# EAGLE design WaterSens_V1-0 (EAGLE 9.6.2)
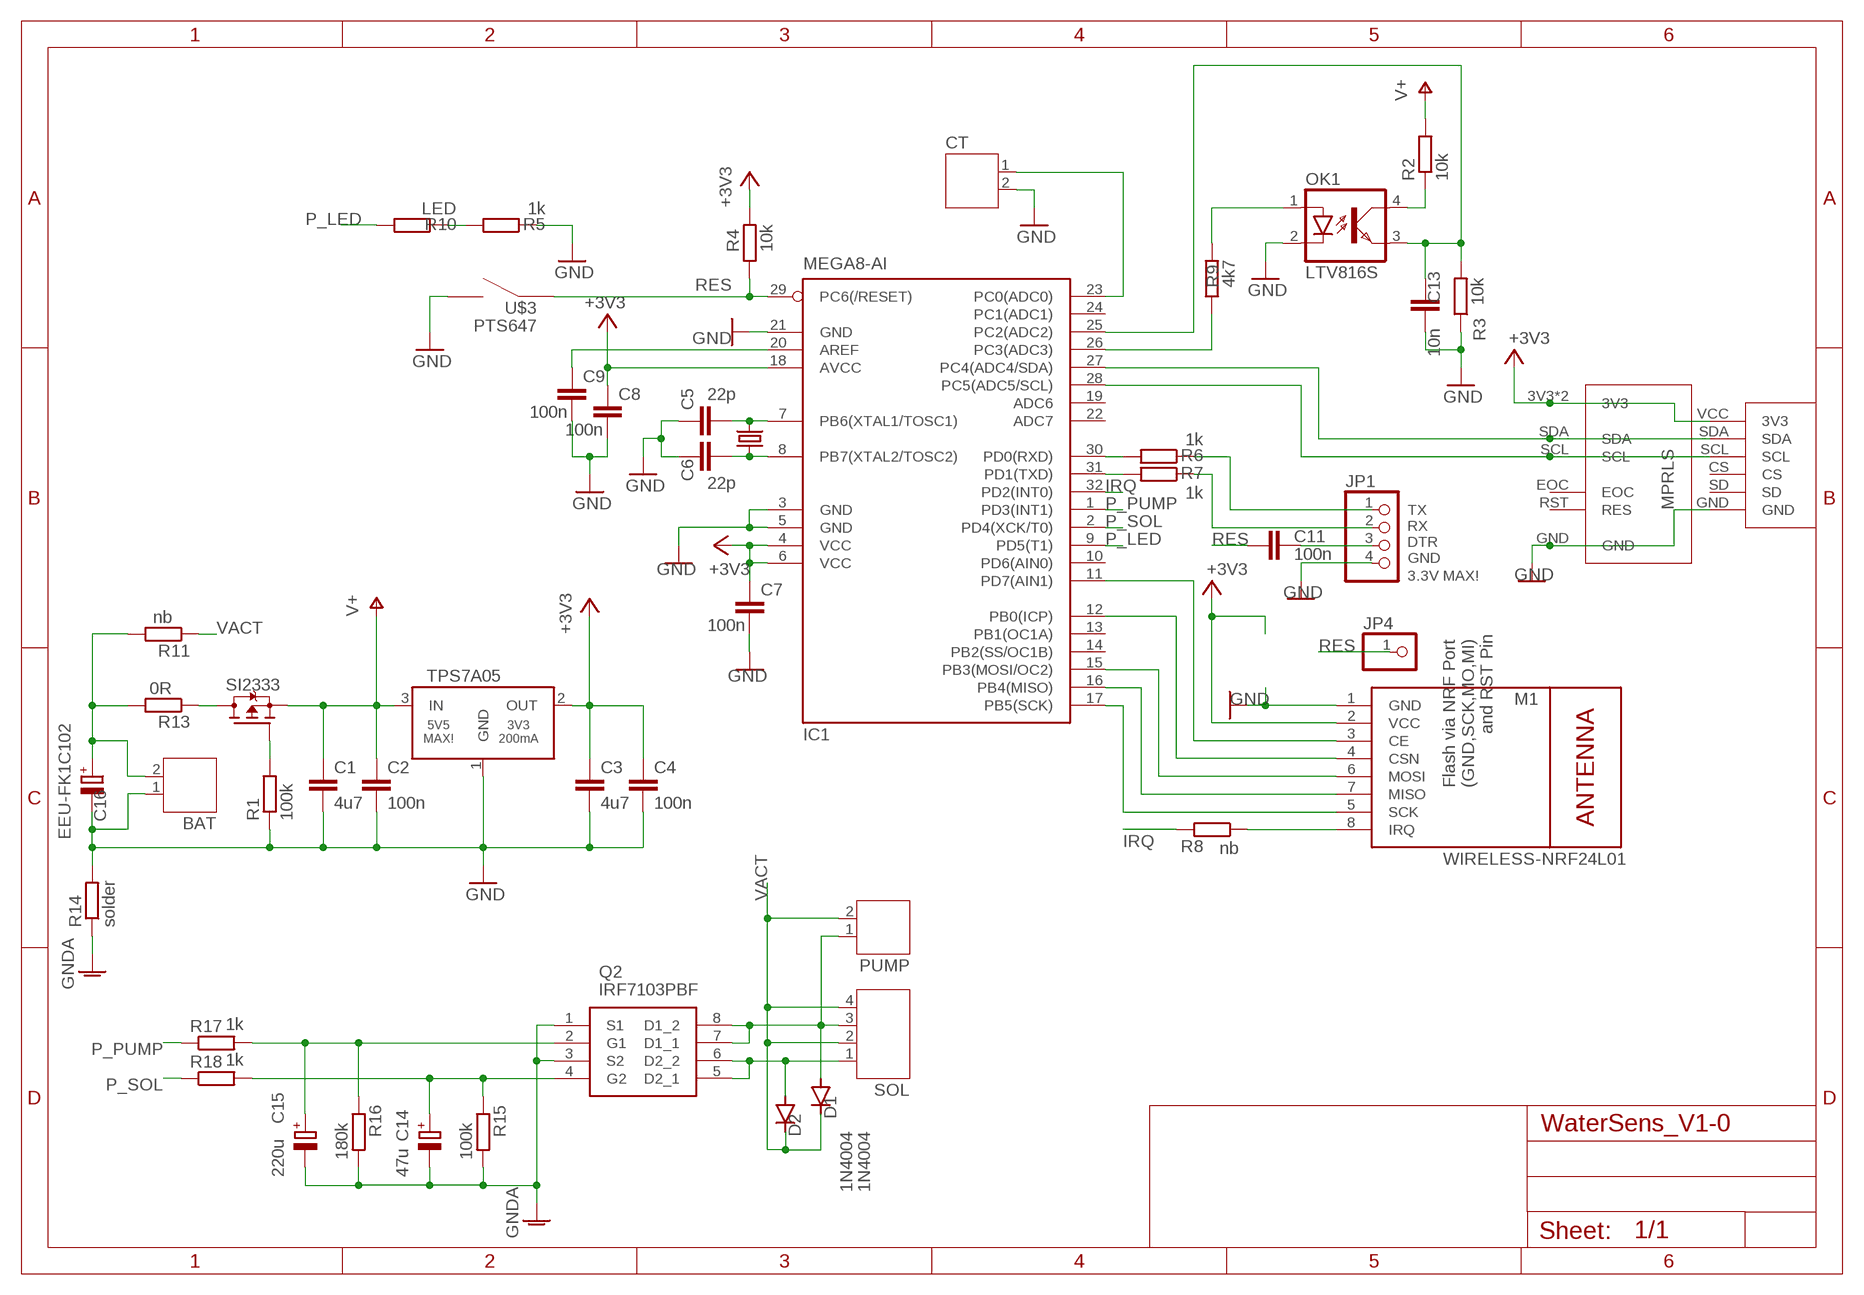
[diagram p0: schematic, sheet 1]

## Parts
BAT  JST-PH2  [JST-PH2]
C1  4u7  C-EUC0805  [C0805]
C2  100n  C-EUC0805  [C0805]
C3  4u7  C-EUC0805  [C0805]
C4  100n  C-EUC0805  [C0805]
C5  22p  C-EUC0805  [C0805]
C6  22p  C-EUC0805  [C0805]
C7  100n  C-EUC0805  [C0805]
C8  100n  C-EUC0805  [C0805]
C9  100n  C-EUC0805  [C0805]
C11  100n  C-EUC0805  [C0805]
C13  10n  C-EUC0805  [C0805]
C14  47u  CPOL-EUE1.8-4  [E1,8-4]
C15  220u  CPOL-EUE2,5-6E  [E2,5-6E]
C16  EEU-FK1C102  CPOL-EUE5-10.5  [E5-10,5]
CT  JST-PH2  [JST-PH2]
D1  1N4004  [DO41-10]
D2  1N4004  [DO41-10]
IC1  MEGA8-AI  [TQFP32-08]
JP1  PINHD-1X4  [1X04]
JP4  PINHD-1X1  [1X01]
M1  WIRELESS-NRF24L01  [WIRELESS-NRF24L01]
OK1  LTV816S  [DIL4-SMD]
PUMP  JST-PH2  [JST-PH2]
Q1  CRYSTALHC49UP  [HC49UP]
Q2  IRF7103PBF  [SOIC127P600X175-8N]
R1  100k  R-EU_R0805  [R0805]
R2  10k  R-EU_R0805  [R0805]
R3  10k  R-EU_R0805  [R0805]
R4  10k  R-EU_R0805  [R0805]
R5  1k  R-EU_R0805  [R0805]
R6  1k  R-EU_R0805  [R0805]
R7  1k  R-EU_R0805  [R0805]
R8  nb  R-EU_R0805  [R0805]
R9  4k7  R-EU_R0805  [R0805]
R10  LED  R-EU_R0805  [R0805]
R11  nb  R-EU_R0805  [R0805]
R13  0R  R-EU_R0805  [R0805]
R14  solder  R-EU_R0805  [R0805]
R15  100k  R-EU_R0805  [R0805]
R16  180k  R-EU_R0805  [R0805]
R17  1k  R-EU_R0805  [R0805]
R18  1k  R-EU_R0805  [R0805]
SOL  JST-PH4  [JST-PH4]
U$1  MPRLS_ADA  [MPRLS_ADA]
U$2  TEMP-HUM-PRES-BME280-3V3  [TEMP-HUM-PRES-BME280-3V3]
U$3  PTS647  [PTS647]
U$5  TPS7A05  [SOT23]
U$6  SI2333  [SOT23]

## Nets
+3V3: C3.1 C4.1 C7.1 C8.1 IC1.4(VCC) IC1.6(VCC) IC1.18(AVCC) M1.2(VCC) R4.2 U$1.3V3 U$1.VIN(3V3) U$2.VCC(3V3) U$5.2(OUT)
GND: BAT.1 C1.2 C2.2 C3.2 C4.2 C5.1 C6.1 C7.2 C8.2 C9.2 C13.1 C16.- CT.2 IC1.3(GND) IC1.5(GND) IC1.21(GND) JP1.4 M1.1(GND) OK1.2(C) R1.1 R3.1 R5.1 R14.2 U$1.GND U$2.GND U$3.3 U$3.4 U$5.1(GND)
GNDA: C14.- C15.- Q2.1(S1) Q2.3(S2) R14.1 R15.2 R16.2
IRQ: IC1.32(PD2(INT0)) R8.2
N$1: IC1.27(PC4(ADC4/SDA)) U$1.SDA U$2.SDA
N$2: IC1.28(PC5(ADC5/SCL)) U$1.SCL U$2.SCL
N$3: BAT.2 C16.+ R11.2 R13.2
N$4: C5.2 IC1.7(PB6(XTAL1/TOSC1)) Q1.2
N$5: R1.2 U$6.1(G)
N$6: OK1.4(COL) R2.1
N$7: C14.+ Q2.4(G2) R15.1 R18.2
N$8: C15.+ Q2.2(G1) R16.1 R17.2
N$9: IC1.26(PC3(ADC3)) R9.1
N$10: C6.2 IC1.8(PB7(XTAL2/TOSC2)) Q1.1
N$11: IC1.11(PD7(AIN1)) M1.3(CE)
N$12: IC1.30(PD0(RXD)) R6.2
N$13: C9.1 IC1.20(AREF)
N$14: OK1.1(A) R9.2
N$15: IC1.31(PD1(TXD)) R7.2
N$16: JP1.1 R6.1
N$17: JP1.2 R7.1
N$18: C11.2 JP1.3
N$19: IC1.12(PB0(ICP)) M1.4(CSN)
N$20: IC1.15(PB3(MOSI/OC2)) M1.6(MOSI)
N$21: IC1.16(PB4(MISO)) M1.7(MISO)
N$22: IC1.17(PB5(SCK)) M1.5(SCK)
N$23: M1.8(IRQ) R8.1
N$24: R5.2 R10.1
N$25: R13.1 U$6.3(D)
N$27: D1.A PUMP.1 Q2.7(D1_1) Q2.8(D1_2) SOL.3
N$28: D2.A Q2.5(D2_1) Q2.6(D2_2) SOL.1
N$30: CT.1 IC1.23(PC0(ADC0))
P_LED: IC1.9(PD5(T1)) R10.2
P_PUMP: IC1.1(PD3(INT1)) R17.1
P_SOL: IC1.2(PD4(XCK/T0)) R18.1
RES: C11.1 IC1.29(PC6(/RESET)) JP4.1 R4.1 U$3.1 U$3.2
U_MESS: C13.2 IC1.25(PC2(ADC2)) OK1.3(EMIT) R3.2
V+: C1.1 C2.1 R2.2 U$5.3(IN) U$6.2(S)
VACT: D1.C D2.C PUMP.2 R11.1 SOL.2 SOL.4
Unconnected: IC1.10(PD6(AIN0)) IC1.13(PB1(OC1A)) IC1.14(PB2(SS/OC1B)) IC1.19(ADC6) IC1.22(ADC7) IC1.24(PC1(ADC1)) U$1.EOC U$1.RST(RES) U$2.CS U$2.SD

## Notes on the sheet
- TX
  RX
  DTR
  GND
- 3.3V MAX!
- Flash via NRF Port 
  (GND,SCK,MO,MI) 
  and RST Pin
- TPS7A05

## Library data of the parts
BAT CT PUMP = jst-ph_:JST-PH2
C1-C9 C11 C13 = rcl:C-EU: CAPACITOR, European symbol; SPICEPREFIX: C
C14-C16 = rcl:CPOL-EU: POLARIZED CAPACITOR, European symbol; SPICEPREFIX: C
D1 D2 = diode:1N4004: DIODE general purpose rectifier, 1 A
IC1 = atmel:MEGA8: MICROCONTROLLER 8 Kbytes FLASH, 1 kbytes SRAM, 512 bytes EEPROM, USART, 6-channel 10 bit ADC, 2-channel 8 bit ADC Pin compatible with Atmega48, ATMega88, ATMega168 Source: avr.lbr; MPN: ATMEGA8-16AU; OC_FARNELL: 9171371; OC_NEWARK: 73M8863
JP1 = pinhead:PINHD-1X4: PIN HEADER
JP4 = pinhead:PINHD-1X1: PIN HEADER
M1 = diy-modules:WIRELESS-NRF24L01: 2.4 GHz Wireless Module based on NRF24L01 chip More details available here: http://www.electrodragon.com/w/NRF24L01 Click here to find device on ebay.com <http://www.ebay.com/sch/nrf24l01+arduino>
OK1 = optocoupler:LTV816: OPTO COUPLER Source: LITEON, LTV816.pdf
Q1 = crystal:CRYSTAL: CRYSTAL; OC_FARNELL: unknown; OC_NEWARK: unknown
Q2 = IRF7103PBF:IRF7103PBF: MOSFET Dual N-Channel 50V 3A SOIC8 International Rectifier IRF7103PBF Dual N-channel MOSFET Transistor, 3 A, 50 V, 8-Pin SOIC Source: Datasheet <http://www.infineon.com/dgdl/irf7103pbf.pdf?fileId=5546d462533600a4015355f0f0141ac6>; ARROW_PART_NUMBER: IRF7103PBF; DESCRIPTION: MOSFET Dual N-Channel 50V 3A SOIC8 International Rectifier IRF7103PBF Dual N-channel MOSFET Transistor, 3 A, 50 V, 8-Pin SOIC; HEIGHT: 1.75mm; MANUFACTURER_NAME: International Rectifier; MANUFACTURER_PART_NUMBER: IRF7103PBF
R1-R11 R13-R18 = rcl:R-EU_: RESISTOR, European symbol; SPICEPREFIX: R
SOL = jst-ph_:JST-PH4
U$1 = MPRLS_ADA:MPRLS_ADA
U$2 = diy-modules:TEMP-HUM-PRES-BME280-3V3
U$3 = smd_taster:PTS647
U$5 = tps7a05:TPS7A05
U$6 = transistor-fet:SI2333

## Board
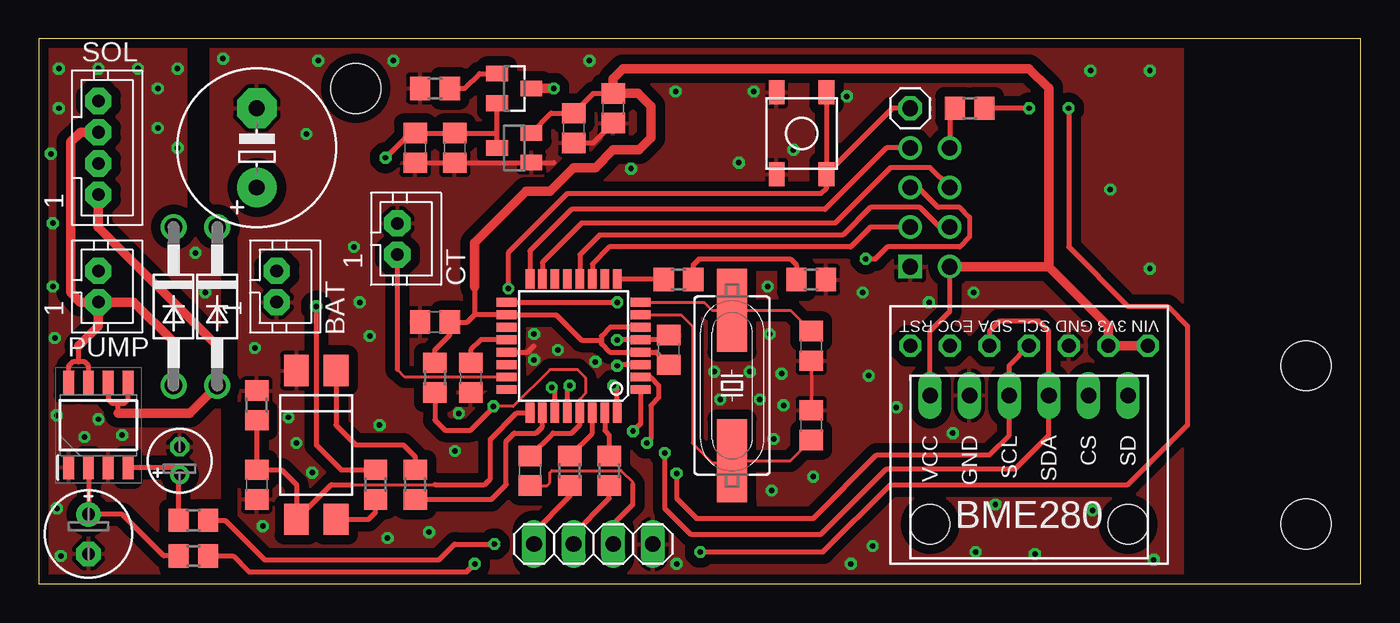
[diagram p1: board, top side]
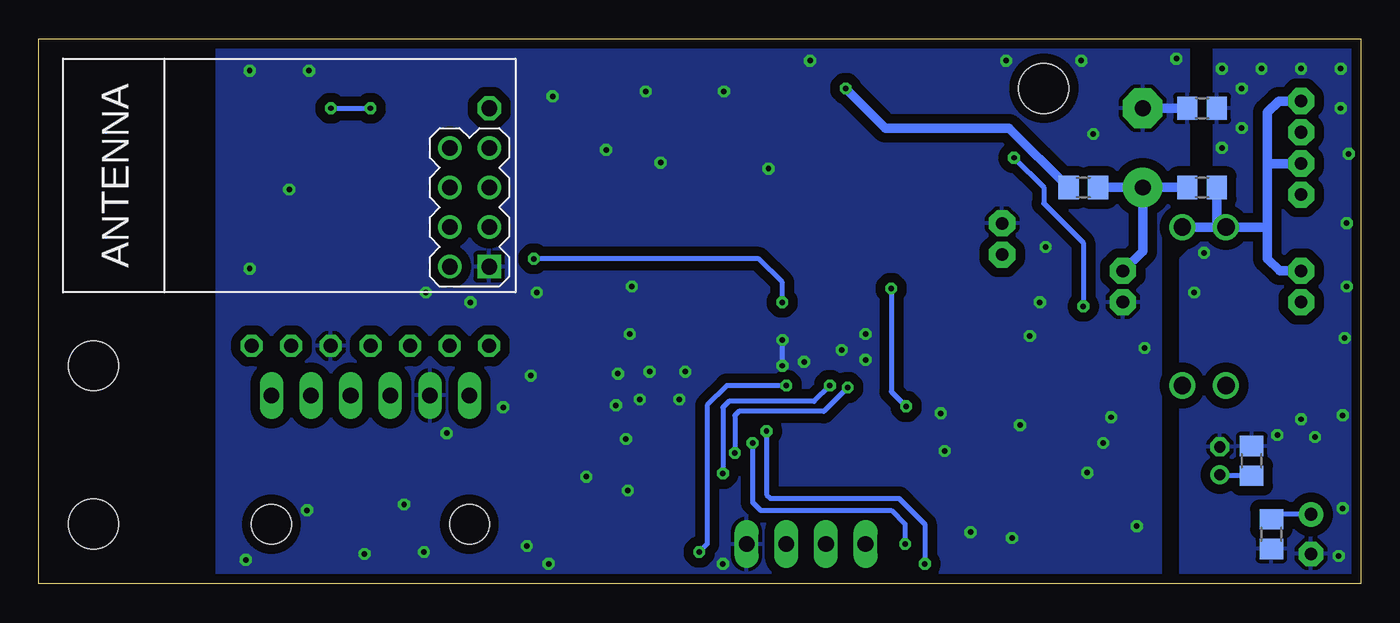
[diagram p2: board, bottom side, seen from below]

Size 84.76 x 34.92 mm. Coordinates in mm from the lower left corner, seen from the top.
Outline: 0,0 84.76,0 84.76,34.92 0,34.92 0,0
Copper layers (1*16): Top 0.035mm / dielectric 1.5mm / Bottom 0.035mm
Design rules "jlcpcb": minimum track width 3.5mil, minimum drill 0.2mm, track to track 3.5mil, track to pad 5mil, pad to pad 5mil, via to via 5mil, smd to smd 5mil, copper to edge 0.2mm, drill to drill 8mil, minimum pad ring 10mil, minimum via ring 8mil, stop-mask expansion 4mil, vias tented up to drill 0mil, thermal gap 10mil
Holes 3.2 mm at 20.32,31.75 81.28,13.97 81.28,3.81

### Footprints (pad centres in the part's own frame; a part is rotated, then mirrored left to right if it is on the bottom)
JST-PH2 = drill 0.813 pad 1.676 octagon: 1 1,0; 2 -1,0
C0805 = smd 1.3 x 1.5: 1 -0.95,0; 2 0.95,0
E1,8-4 = drill 0.711 pad 1.168: + -0.889,0 | drill 0.711 pad 1.168 octagon: - 0.889,0
E2,5-6E = drill 0.813 pad 1.575: + -1.27,0 | drill 0.813 pad 1.575 octagon: - 1.27,0
E5-10,5 = drill 1.016 pad 2.54: + -2.54,0 | drill 1.016 pad 2.54 octagon: - 2.54,0
DO41-10 = drill 1.118: A 5.08,0; C -5.08,0
TQFP32-08 = smd 1.27 x 0.559: 1 -4.293,2.8; 2 -4.293,2; 3 -4.293,1.2; 4 -4.293,0.4; 5 -4.293,-0.4; 6 -4.293,-1.2; 7 -4.293,-2; 8 -4.293,-2.8; 17 4.293,-2.8; 18 4.293,-2; 19 4.293,-1.2; 20 4.293,-0.4; 21 4.293,0.4; 22 4.293,1.2; 23 4.293,2; 24 4.293,2.8 | smd 0.559 x 1.27: 9 -2.8,-4.293; 10 -2,-4.293; 11 -1.2,-4.293; 12 -0.4,-4.293; 13 0.4,-4.293; 14 1.2,-4.293; 15 2,-4.293; 16 2.8,-4.293; 25 2.8,4.293; 26 2,4.293; 27 1.2,4.293; 28 0.4,4.293; 29 -0.4,4.293; 30 -1.2,4.293; 31 -2,4.293; 32 -2.8,4.293
1X04 = drill 1.016 long: 1 -3.81,0; 2 -1.27,0; 3 1.27,0; 4 3.81,0
1X01 = drill 1.016 octagon: 1 0,0
WIRELESS-NRF24L01 = drill 1 square: 1 -12.7,6.35 | drill 1: 2 -10.16,6.35; 3 -12.7,3.81; 4 -10.16,3.81; 5 -12.7,1.27; 6 -10.16,1.27; 7 -12.7,-1.27; 8 -10.16,-1.27
DIL4-SMD = smd 1.6 x 2: 1 -1.27,-4.77; 2 1.27,-4.77; 3 1.27,4.77; 4 -1.27,4.77
HC49UP = smd 5.334 x 1.93: 1 -4.826,0; 2 4.826,0
SOIC127P600X175-8N = smd 1.525 x 0.7: 1 -2.712,1.905; 2 -2.712,0.635; 3 -2.712,-0.635; 4 -2.712,-1.905; 5 2.712,-1.905; 6 2.712,-0.635; 7 2.712,0.635; 8 2.712,1.905
R0805 = smd 1.3 x 1.5: 1 -0.95,0; 2 0.95,0
JST-PH4 = drill 0.813 pad 1.676 octagon: 1 3,0; 2 1,0; 3 -1,0; 4 -3,0
MPRLS_ADA = drill 0.9 octagon: 3V3 -5.08,2.54; EOC 5.08,2.54; GND -2.54,2.54; RST 7.62,2.54; SCL 0,2.54; SDA 2.54,2.54; VIN -7.62,2.54 | hole 2.54: -6.35,13.97; 6.35,13.97
TEMP-HUM-PRES-BME280-3V3 = drill 1 long: CS 3.81,1.27; GND 11.43,1.27; SCL 8.89,1.27; SD 1.27,1.27; SDA 6.35,1.27; VCC 13.97,1.27
PTS647 = smd 1.55 x 1: 1 -0.381,3.835; 2 4.869,3.835; 3 -0.381,0.635; 4 4.869,0.635
SOT23 = smd 1 x 1.4: 1 -0.95,-1.1; 2 0.95,-1.1; 3 0,1.1

### Placement (x,y rotation side)
BAT  15.24,19.05 270 top
C1  24.13,27.94 270 top
C2  26.67,27.94 270 top
C3  36.83,30.48 270 top
C4  34.29,29.21 270 top
C5  49.53,10.16 270 top
C6  49.53,15.24 90 top
C7  40.39,14.99 90 top
C8  25.4,16.76 180 top
C9  27.69,13.21 270 top
C11  31.5,7.24 270 top
C13  13.97,6.35 90 top
C14  9.02,7.87 90 top
C15  3.17,3.17 270 top
C16  13.97,27.94 90 top
CT  22.99,22.1 270 top
D1  8.64,17.78 270 top
D2  11.43,17.78 270 top
IC1  34.29,15.24 180 top
JP1  35.56,2.54 0 top
JP4  55.88,30.48 0 top
M1  68.58,26.67 180 bottom
OK1  17.78,8.89 180 top
PUMP  3.81,19.05 270 top
Q1  44.45,12.7 270 top
Q2  3.81,10.16 90 top
R1  25.4,31.75 0 top
R2  21.59,6.35 90 top
R3  13.97,11.43 270 top
R4  25.4,13.21 90 top
R5  49.53,19.49 180 top
R6  34.04,7.24 90 top
R7  36.58,7.24 90 top
R8  59.69,30.48 0 top
R9  24.13,6.35 90 top
R10  41.02,19.49 180 top
R11  10.16,25.4 180 bottom
R13  17.78,25.4 0 bottom
R14  10.16,30.48 180 bottom
R15  6.99,7.87 90 bottom
R16  5.71,3.17 270 bottom
R17  9.91,1.78 180 top
R18  9.91,4.06 180 top
SOL  3.81,27.94 270 top
U$1  63.5,17.78 180 top
U$2  71.12,13.34 180 top
U$3  46.67,31.11 270 top
U$5  30.48,27.94 90 top
U$6  30.48,31.75 270 top

### Tracks (layer width: path | path; a pad name or v marks a point on that pad's centre or on a via)
+3V3
  Top 0.305: IC1.6 36.63,16.44 36.07,15.88 36.07,15.62 | 36.07,15.62 36.07,15.37 36.59,14.84 IC1.4 39.58,14.84 C7.1 | 36.07,15.62 34.8,15.62 33.18,17.24 IC1.18 27.94,17.24 | 27.94,19.05 27.94,17.24 | 27.94,17.24 27.46,16.76 C8.1 26.35,15.94 25.4,14.99 R4.2 | U$5.2 32.85,30.16 C4.1 35.56,31.43 C3.1 | U$2.VCC 57.15,16.19 58.42,17.46 M1.2
  Top 0.61: 64.77,20.32 64.77,31.75 63.5,33.02 37.47,33.02 36.83,32.38 C3.1 38.42,31.43 39.24,30.61 39.24,28.57 38.48,27.81 36.83,27.81 35.69,26.67 34.29,26.67 32.77,25.15 31.24,25.15 27.94,21.84 27.94,19.05 | M1.2 64.77,20.32 | U$1.VIN U$1.3V3 68.58,16.51 64.77,20.32
GND  (via drill 0.35)
  Top 0.2: C6.1 C5.1
  Top 0.305: C1.2 C2.2 U$5.1 33.02,26.99 | C7.2 40.09,15.64 IC1.5 37.1,15.64 v37.08,15.62 | IC1.3 37.15,14.04 v37.08,13.97 | C4.2 35.56,28.26 C3.2 | IC1.21 31.35,14.84 31.75,15.24
  Bottom 0.305: v37.08,13.97 v37.08,15.62
  Bottom 0.61: C16.- R14.2
  other vias: 31.75,16 31.75,14.35 33.27,14.99 35.69,14.22 43.31,13.59 43.69,11.81 45.59,13.59 46.23,11.81 46.86,16 47.62,13.46 47.75,11.43 47.12,9.27 46.74,19.05 46.99,5.97 49.66,6.86 58.61,9.65 57.09,18.03 52.83,18.67 53.21,13.34 54.99,11.3 71.5,1.52 67.56,4.7 63.88,1.91 61.34,5.08 60.07,2.03 53.47,2.41 52.07,1.27 40.89,1.27 22.35,2.92 25.02,3.3 26.67,8.51 21.84,10.16 21.21,15.88 20.19,21.59 20.57,18.03 11.81,33.66 17.91,33.53 22.73,33.53 17.14,28.83 40.83,31.56 51.82,31.24 48.39,27.81 44.89,26.99 45.85,31.56 13.84,15.11 16,10.67 16.51,9.02 26.92,10.92 14.35,3.68 17.53,7.11 71.25,20.19 68.71,25.27 71.25,32.89 67.44,32.89 35.31,33.53 37.97,26.61 59.94,18.67
  pour Bottom (isolate 0.61): 11.05,35.56 11.05,24.51 12.83,22.73 12.83,-1.27 73.34,-1.27 73.34,35.56
  pour Top (isolate 0.61): 11.05,35.56 73.34,35.56 73.34,-1.27 12.83,-1.27 12.83,22.73 11.05,24.51
GNDA  (via drill 0.35)
  other vias: 1.27,33.02 3.81,33.02 6.35,33.02 8.89,33.02 7.62,31.75 7.62,29.21 8.89,27.94 1.27,30.48 0.76,27.56 0.89,23.11 0.89,19.05 1.02,15.75 1.14,10.79 2.92,9.4 3.81,10.54 5.33,9.53 10.03,21.21 10.67,18.67 1.4,1.78 1.14,4.83
  pour Top (isolate 0.61): 9.4,35.56 9.4,22.99 11.56,20.83 11.56,-1.27 -1.27,-1.27 -1.27,35.56
  pour Bottom (isolate 0.61): -1.27,35.56 9.4,35.56 9.4,22.99 11.56,20.83 11.56,-1.27 -1.27,-1.27
IRQ  (via drill 0.35)
  Top 0.305: IC1.32 37.09,12.44 v36.83,12.7 | v42.42,2.03 50.29,2.03 54.61,6.35 69.85,6.35 73.66,10.16 73.66,16.51 72.39,17.78 69.85,17.78 66.04,21.59 v66.04,30.48 | v63.5,30.48 R8.2
  Bottom 0.305: v36.83,12.7 40.64,12.7 41.91,11.43 41.91,2.54 v42.42,2.03 | v66.04,30.48 v63.5,30.48
N$1  (via drill 0.35)
  Top 0.305: IC1.27 33.09,12.38 v32.89,12.57 | v40.13,8.38 40.13,4.83 41.78,3.17 50.16,3.17 54.36,7.37 62.61,7.37 64.77,9.53 U$2.SDA 64.77,16.19 64.14,16.83 61.59,16.83 60.96,16.19 U$1.SDA
  Bottom 0.305: v32.89,12.57 34.42,11.05 39.88,11.05 40.13,10.79 v40.13,8.38
N$2  (via drill 0.35)
  Top 0.305: IC1.28 33.89,12.43 34.04,12.57 v34.04,12.7 | v40.89,7.07 40.89,5.46 42.16,4.19 49.66,4.19 53.72,8.26 60.96,8.26 62.23,9.53 U$2.SCL 62.23,13.97 U$1.SCL
  Bottom 0.305: v34.04,12.7 35.05,11.68 40.51,11.68 40.89,11.3 v40.89,7.07
N$3
  Bottom 0.61: C16.+ R11.2 | BAT.2 13.97,21.32 C16.+ | C16.+ R13.2
N$4
  Top 0.2: IC1.7 41.18,17.24 41.91,16.51 41.91,9.02 43.18,7.75 44.32,7.75 Q1.2 48.19,7.87 C5.2
N$5
  Top 0.305: R1.2 27.3,31.75 28.25,32.7 U$6.1
N$6
  Top 0.305: OK1.4 21.14,4.12 21.59,4.57 R2.1
N$7
  Top 0.305: Q2.4 8.55,7.45 C14.+ 8.96,6.92 R18.2
  Bottom 0.305: R15.1 8.96,6.92 C14.+
N$8
  Top 0.305: Q2.2 C15.+ 5.33,4.45 8,1.78 R17.2
  Bottom 0.305: C15.+ 5.39,4.45 R16.1
N$9
  Top 0.305: R9.1 29.02,5.4 29.97,6.35 29.97,9.14 30.48,9.65 31.88,9.65 32.29,10.06 IC1.26
N$10
  Top 0.2: IC1.8 42.67,18.04 43.18,17.53 Q1.1 48.19,17.53 C6.2
N$11
  Top 0.305: M1.3 53.34,22.86 52.07,21.59 36.58,21.59 35.49,20.5 IC1.11
N$12
  Top 0.305: R6.2 35.49,9.64 IC1.30
N$13
  Top 0.305: IC1.20 28.34,15.64 27.69,14.99 C9.1
N$14
  Top 0.305: OK1.1 19.05,10.16 20.32,8.89 23.37,8.89 24.13,8.13 R9.2
N$15
  Top 0.305: IC1.31 36.29,9.81 36.58,9.53 R7.2
N$16
  Top 0.305: R6.1 34.04,5.59 31.75,3.3 JP1.1
N$17
  Top 0.305: R7.1 36.58,5.46 34.29,3.17 JP1.2
N$18
  Top 0.2: 38.1,6.35 38.1,6.49 37.35,7.24 32.89,7.24 32.77,7.11 32.77,6.48 32.58,6.29 C11.2
  Top 0.305: JP1.3 36.83,3.81 38.1,5.08 38.1,6.35
N$19
  Top 0.305: IC1.12 34.69,21.1 35.94,22.35 51.56,22.35 53.34,24.13 56.52,24.13 57.78,22.86 M1.4
N$20
  Top 0.305: M1.6 57.15,26.67 54.61,26.67 51.05,23.11 34.8,23.11 32.29,20.61 IC1.15
N$21
  Top 0.305: M1.7 54.36,27.94 50.42,24 34.16,24 31.49,21.33 IC1.16
N$22  (via drill 0.35)
  Top 0.305: IC1.17 v37.09,18.04 | v53.02,20.83 53.66,20.83 54.42,21.59 59.05,21.59 59.69,22.23 59.69,23.5 59.05,24.13 57.66,24.13 56.39,25.4 M1.5
  Bottom 0.305: v37.09,18.04 37.09,19.31 38.61,20.83 v53.02,20.83
N$23
  Top 0.305: R8.1 58.42,30.16 M1.8
N$24
  Top 0.305: R10.1 41.97,20.45 42.35,20.83 48.2,20.83 48.58,20.45 R5.2
N$25  (via drill 0.35)
  Top 0.61: v33.02,31.75 U$6.3
  Bottom 0.61: v33.02,31.75 30.48,29.21 22.54,29.21 R13.1
N$27
  Top 0.305: Q2.8 1.91,13.97 2.16,14.22 2.54,14.22 | Q2.7 3.17,13.97 2.92,14.22 2.54,14.22 | 2.54,14.22 2.54,15.24
  Top 0.61: PUMP.1 6.08,18.05 8.64,15.49 D1.A | PUMP.1 2.65,18.05 2.03,18.67 2.03,28.32 2.67,28.96 3.79,28.96 SOL.3 | 2.54,15.24 3.81,16.51 PUMP.1
N$28
  Top 0.305: Q2.6 4.45,11.81 4.7,11.56 5.08,11.56 | 5.08,11.56 5.46,11.56 5.71,11.81 Q2.5 | 5.08,10.92 5.08,11.56
  Top 0.61: SOL.1 3.81,22.86 11.43,15.24 D2.A 9.65,10.92 5.08,10.92
N$30
  Top 0.2: IC1.23 23.46,13.24 22.99,13.72
  Top 0.305: 22.99,13.72 CT.1
P_LED
  Top 0.305: IC1.9 40.03,19.53 R10.2
P_PUMP  (via drill 0.35)
  Top 0.305: R17.1 12.45,1.78 13.46,0.76 27.43,0.76 v27.94,1.27 | IC1.1 38.58,10.26 v38.1,9.78
  Bottom 0.305: v38.1,9.78 38.1,5.71 37.85,5.46 29.59,5.46 27.94,3.81 v27.94,1.27
P_SOL  (via drill 0.35)
  Top 0.305: R18.1 11.94,4.06 14.48,1.52 25.65,1.52 26.67,2.54 v29.21,2.54 | IC1.2 39.21,13.24 39.75,12.7 39.75,11.94 39.24,11.43 39.24,9.27 v38.99,9.02
  Bottom 0.305: v38.99,9.02 38.99,5.21 38.48,4.7 30.1,4.7 29.21,3.81 v29.21,2.54
RES  (via drill 0.35)
  Top 0.2: IC1.29 34.69,11.83 35.05,12.19 35.05,13.21 34.54,13.72 32.77,13.72 30.42,11.37 29.21,11.37 v29.15,11.37
  Top 0.305: C11.1 32.96,9.65 34.16,9.65 34.69,10.18 IC1.29 | v30.1,18.92 30.1,21.21 33.91,25.02 50.16,25.02 50.51,25.36 U$3.2 | 29.21,11.37 27.69,9.84 26.04,9.84 25.4,10.48 R4.1 | JP4.1 54.74,30.48 U$3.2 | U$3.1 U$3.2
  Bottom 0.305: v30.1,18.92 30.1,12.32 v29.15,11.37
U_MESS
  Top 0.2: 20.07,6.35 25.4,6.35
  Top 0.305: R3.2 C13.2 15.56,7.3 16.51,6.35 OK1.3 18.74,6.35 20.07,6.35 | 25.4,6.35 28.57,6.35 28.96,6.73 28.96,9.27 30.63,10.95 IC1.25
V+  (via drill 0.35)
  Top 0.305: 29.38,28.89 U$6.2 | U$5.3 29.38,28.89 | 29.38,28.89 C2.1 C1.1 23.81,28.89 v22.23,27.3 | v17.78,17.78 17.78,8.89 19.37,7.3 R2.2
  Bottom 0.305: v22.23,27.3 20.32,25.4 20.32,24.38 17.78,21.84 v17.78,17.78
VACT
  Bottom 0.61: SOL.4 5.25,30.94 5.97,30.23 5.97,26.92 | 5.97,26.92 3.83,26.92 SOL.2 | 9.14,22.86 D1.C 5.97,22.86 | 9.14,22.86 D2.C | 5.97,22.86 5.97,26.92 | PUMP.2 5.19,20.05 5.97,20.83 5.97,22.86 | R11.1 9.21,22.93 9.14,22.86

### Text on the board
tValues: RES | TPS | RES / MI IRQ / SCK MO / CE CSN / GND VCC | WaterSens V1.0 / (c) Ludwig Bre / 07-2020 | TX RX DTR GND
bValues: RES / IRQ MI / MO SCK / CSN CE / VCC GND | VCC / GND / SCL / SDA / CS / SD